# Altium schematic sheet start.SchDoc
size A; SheetNumber: 1; SheetTotal: 1
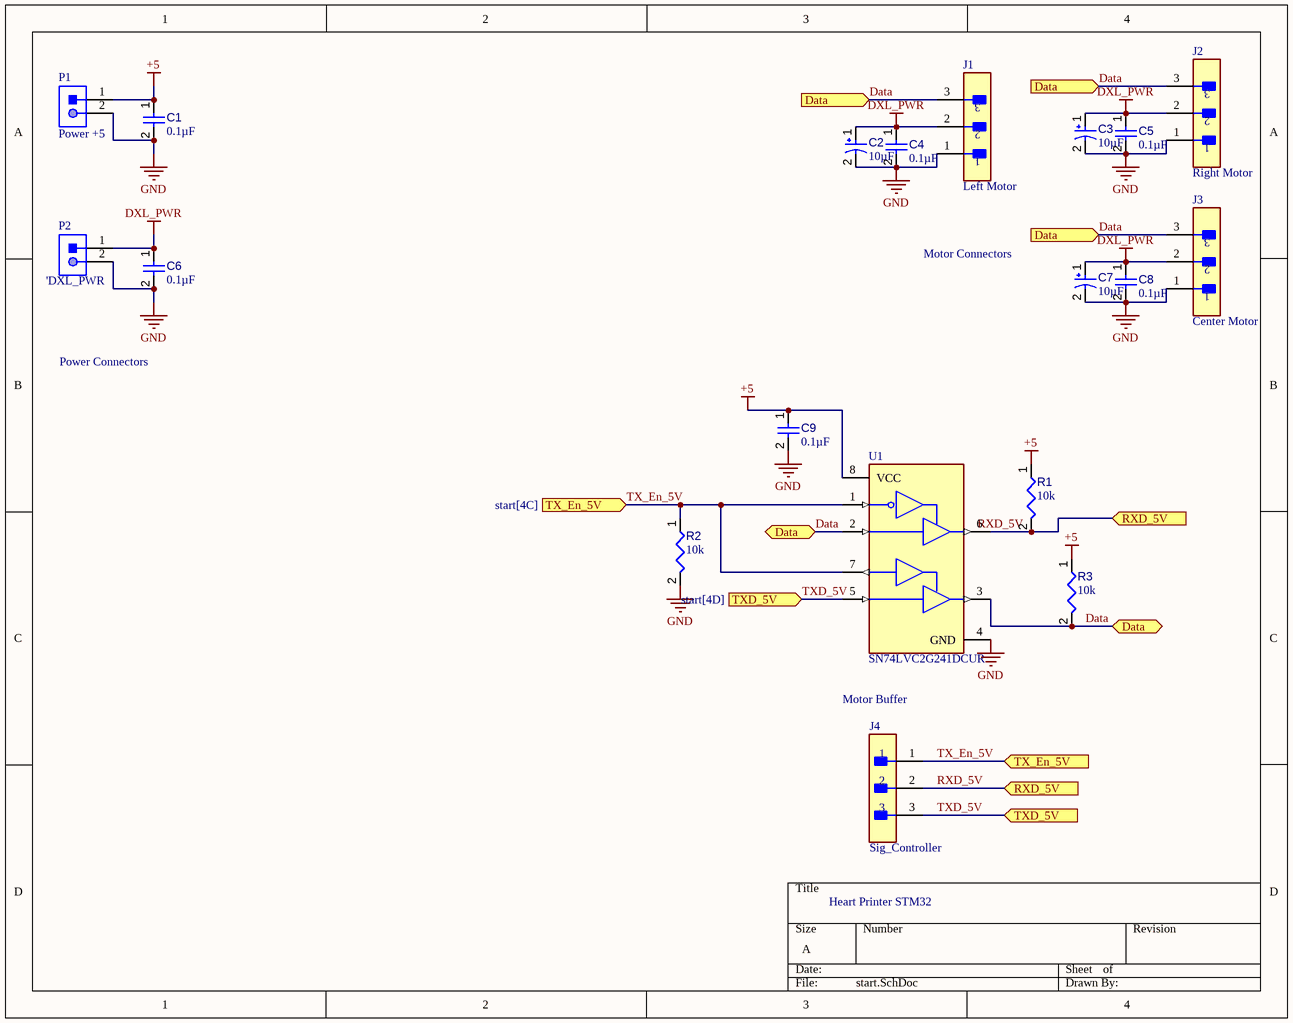
[diagram p0: start.SchDoc]

## Parts
C1  value 0.1µF  [CAPC1005X55X25ML5T10]  (hidden comment: Capacitor 1 uF +/- 10% 6.3 V 1005)
C2  value 10µF  [CAPPR55-200-1100X500X1200]  (hidden comment: ECA1HM2R2)
C3  value 10µF  [CAPPR55-200-1100X500X1200]  (hidden comment: ECA1HM2R2)
C4  value 0.1µF  [CAPC1005X55X25ML5T10]  (hidden comment: Capacitor 1 uF +/- 10% 6.3 V 1005)
C5  value 0.1µF  [CAPC1005X55X25ML5T10]  (hidden comment: Capacitor 1 uF +/- 10% 6.3 V 1005)
C6  value 0.1µF  [CAPC1005X55X25ML5T10]  (hidden comment: Capacitor 1 uF +/- 10% 6.3 V 1005)
C7  value 10µF  [CAPPR55-200-1100X500X1200]  (hidden comment: ECA1HM2R2)
C8  value 0.1µF  [CAPC1005X55X25ML5T10]  (hidden comment: Capacitor 1 uF +/- 10% 6.3 V 1005)
C9  value 0.1µF  [CAPC1005X55X25ML5T10]  (hidden comment: Capacitor 1 uF +/- 10% 6.3 V 1005)
J1  Left Motor  [FP-B3B-ZR_LF_SN-MFG]
J2  Right Motor  [FP-B3B-ZR_LF_SN-MFG]
J3  Center Motor  [FP-B3B-ZR_LF_SN-MFG]
J4  Sig_Controller  [FP-B3B-ZR_LF_SN-MFG]
P1  Power +5  [JST-S2B-XH-A(LF)(SN)_V]
P2  'DXL_PWR  [JST-S2B-XH-A(LF)(SN)_V]
R1  value 10k  [RESC3216X60X45ML15T20]  (hidden comment: Resistor 10k +/-1% 1206 250 mW)
R2  value 10k  [RESC3216X60X45ML15T20]  (hidden comment: Resistor 10k +/-1% 1206 250 mW)
R3  value 10k  [RESC3216X60X45ML15T20]  (hidden comment: Resistor 10k +/-1% 1206 250 mW)
U1  SN74LVC2G241DCUR  [FP-DCU0008A-MFG]

## Ports
Data (bidir, see start[3A], start[3C], start[4A]), Data (bidir, see start[3A], start[4A], start[4C]), Data (in, see start[3A], start[3C], start[4A], start[4C]), Data (in, see start[3C], start[4A], start[4C]), RXD_5V (in, see start[4C]), RXD_5V (in, see start[4D]), TX_En_5V (in, see start[2B]), TX_En_5V (in, see start[4C]), TXD_5V (in, see start[3C]), TXD_5V (in, see start[4D])

## Nets
+5: C1.1 C9.1 P1.1 R1.1 R3.1 U1.8(VCC)
DXL_PWR: C2.1 C3.1 C4.1 C5.1 C6.1 C7.1 C8.1 J1.2 J2.2 J3.2 P2.1
GND: C1.2 C2.2 C3.2 C4.2 C5.2 C6.2 C7.2 C8.2 C9.2 J1.1 J2.1 J3.1 P1.2 P2.2 R2.2 U1.4(GND)
Data: J1.3 J2.3 J3.3 R3.2 U1.2(1A) U1.3(2Y) ; port Data
RXD_5V: J4.2 R1.2 U1.6(1Y) ; port RXD_5V
TX_En_5V: J4.1 R2.1 U1.1(1~{OE}) U1.7(2OE) ; port TX_En_5V
TXD_5V: J4.3 U1.5(2A) ; port TXD_5V

## Notes on the sheet
- Motor Connectors
- Power Connectors
- Motor Buffer
- Heart Printer STM32
- Labels drawn without touching a wire or pin: RXD_5V

## Library data of the parts
C1 C4-C6 C8 C9 = CMP-001-00009-6: Chip Capacitor, 1 uF, +/- 10%, 6.3 V, 1005 (0402 Metric); Voltage Rating: 6.3V; Capacitor Type: Ceramic; Min Operating Temperature: -55°C; Case/Package: 0402; Tolerance: 10%; Mounting Technology: SM; Max Operating Temperature: 85°C; RoHS Compliant: True; Pins: 2
C2 C3 C7 = CMP-001-00029-7: Aluminum Electrolytic Capacitor, 2.2 uF, +/- 20%, 50 V, -40 to 85 degC, 2-Pin THD, RoHS, Bulk; Manufacturer: Panasonic; Voltage Rating: 50V; Ripple Current: 20mA; Package Description: 2-Pin Radial Lead, Dia 5 mm, Height 12 mm; Manufacturer URL: http://www.panasonic.com/; Tolerance: 20%; Diameter: 5mm; Pins: 2; Mounting Technology: TH; Capacitor Type: Electrolytic; RoHS Compliant: True; Min Operating Temperature: -40°C; Case/Package: Radial; Datasheet URL: https://industrial.panasonic.com/cdbs/www-data/pdf/RDF0000/ABA0000C1218.pdf; Lead Pitch: 2mm; Max Operating Temperature: 85°C; Packaging: Bulk; Package Reference: CAPPR55-200-1100X500X1200; Datasheet Version: Rev. 05, 10/2016; Ripple Current (AC): 20mA; Package Quantity: 200
J1-J4 = CMP-17439-000041-1: CONN HEADER VERT 3POS 1.5MM; Gender: Male; Max Voltage Rating (AC): 50V; Body Plating: Tin; Panel Thickness: 3.5mm; Number of Contacts: 3; Connector Type: Male Pin; Max Current Rating: 1A; Insulation Resistance: 500MR; Contact Resistance: 30mR; Pitch: 1.5mm; Lead Pitch: 1.5mm; Termination: Solder; Material: Nylon; Depth: 3.5mm; Min Operating Temperature: -25°C; Voltage Rating (DC): 50V; Number of Positions: 3; Voltage Rating (AC): 50V; Contact Plating: Tin; Housing Material: Polyamide; Mount: Through Hole; Number of Rows: 1; Series: ZH; Lead Free: Lead Free; Flammability Rating: UL94 V-0; Housing Color: Beige; REACH SVHC: No SVHC; Current Rating: 1A; Contact Type: Male Pin; Orientation: Straight; Voltage Rating: 50V; Packaging: Bulk; Color: Natural; Length: 6mm; Contact Material: Copper; Max Operating Temperature: 85°C; Fastening Type: Detent; Contact Mating Length: 0.094inch
P1 P2 = CMP-1755-00005-1: Male Header, Pitch 2.5 mm, 1 x 2 Position, Height 6.1 mm, Tail Length 3.4 mm, -25 to 85 degC, RoHS, Bulk; Type (Capacitors): X7R; Voltage Rating (DC): 100 V; Tolerance: 10%; Capacitance: 1 nF; Case\Package: Radial; Min Operating Temperature: -55 degC; Mount: Through Hole; Package Quantity: 500; PackageReference: S2B-XH-A(LF)(SN); ComponentLink1Description: Manufacturer URL; Max Operating Temperature: 125 degC; ComponentLink2Description: Datasheet; RoHSCompliant: true; PackageDescription: Male Header, Pitch 2.5 mm, 1 x 2 Position, Height 6.1 mm, Tail Length 3.4 mm; REACH SVHC: No SVHC; Packaging: Bulk; Width: 3.81 mm; Length: 5.33 mm; Height: 2.54 mm; Pins: 2; Radiation Hardening: No; ComponentLink1URL: http://www.jst.com/home2.html; Lead Pitch: 2.54 mm; DatasheetVersion: May-16; Voltage Rating: 100 V; ComponentLink2URL: http://www.jst-mfg.com/product/pdf/eng/eXH.pdf
R1-R3 = CMP-009-00016-5: Chip Resistor, 10 KOhm, +/- 1%, 0.25 W, -55 to 155 degC, 1206 (3216 Metric); Power: 250mW; Voltage Rating: 200V; Pins: 2; Max Operating Temperature: 155°C; Tolerance: 1%; RoHS Compliant: True; Case/Package: 1206; Min Operating Temperature: -55°C; Mounting Technology: SM
U1 = CMP-0859-00580-4: IC BUFFER NON-INVERT 5.5V US8; Manufacturer: Texas Instruments; Min Supply Voltage: 1.65V; Number Of Circuits: 2; Max Junction Temp: +150°C; Propagation Delay: 4.2ns; Standoff Height: 0mm; Nominal Supply Current: 10uA; Logic Function Desc: Non-Inverting; Number Of Outputs: 1; Digikey Description: IC BUFFER NON-INVERT 5.5V US8; Max Supply Voltage: 5.5V; Category: IC; Lead Free: Yes; Height: 0.9mm; Device Class L1: Integrated Circuits (ICs); Octopart: https://octopart.com/sn74lvc2g241dcur-texas+instruments-422866; Device Class L2: Logic ICs; Automotive: No; Ambient Temperature Range High: +85°C; Ambient Temperature Range Low: -40°C; ComponentLink2Description: Datasheet; ComponentLink2URL: http://www.ti.com/lit/ds/symlink/sn74lvc2g241.pdf; Temperature Range Low: -40°C; Package: DCU0008A; Device Class L3: Buffers; RoHS: TRUE; Mouser Description: Buffers & Line Drivers Tri-State Dual; Temperature: -40°C to +125°C; Number Of Inputs: 1; Manufacturer Part Number: SN74LVC2G241DCUR; Temperature Range High: +125°C